# Altium project LAUNCHXL-CC1310.PrjPcb (part 2 of 4)

## Sheet 2_Peripherals.SchDoc
size 420 x 297 mm
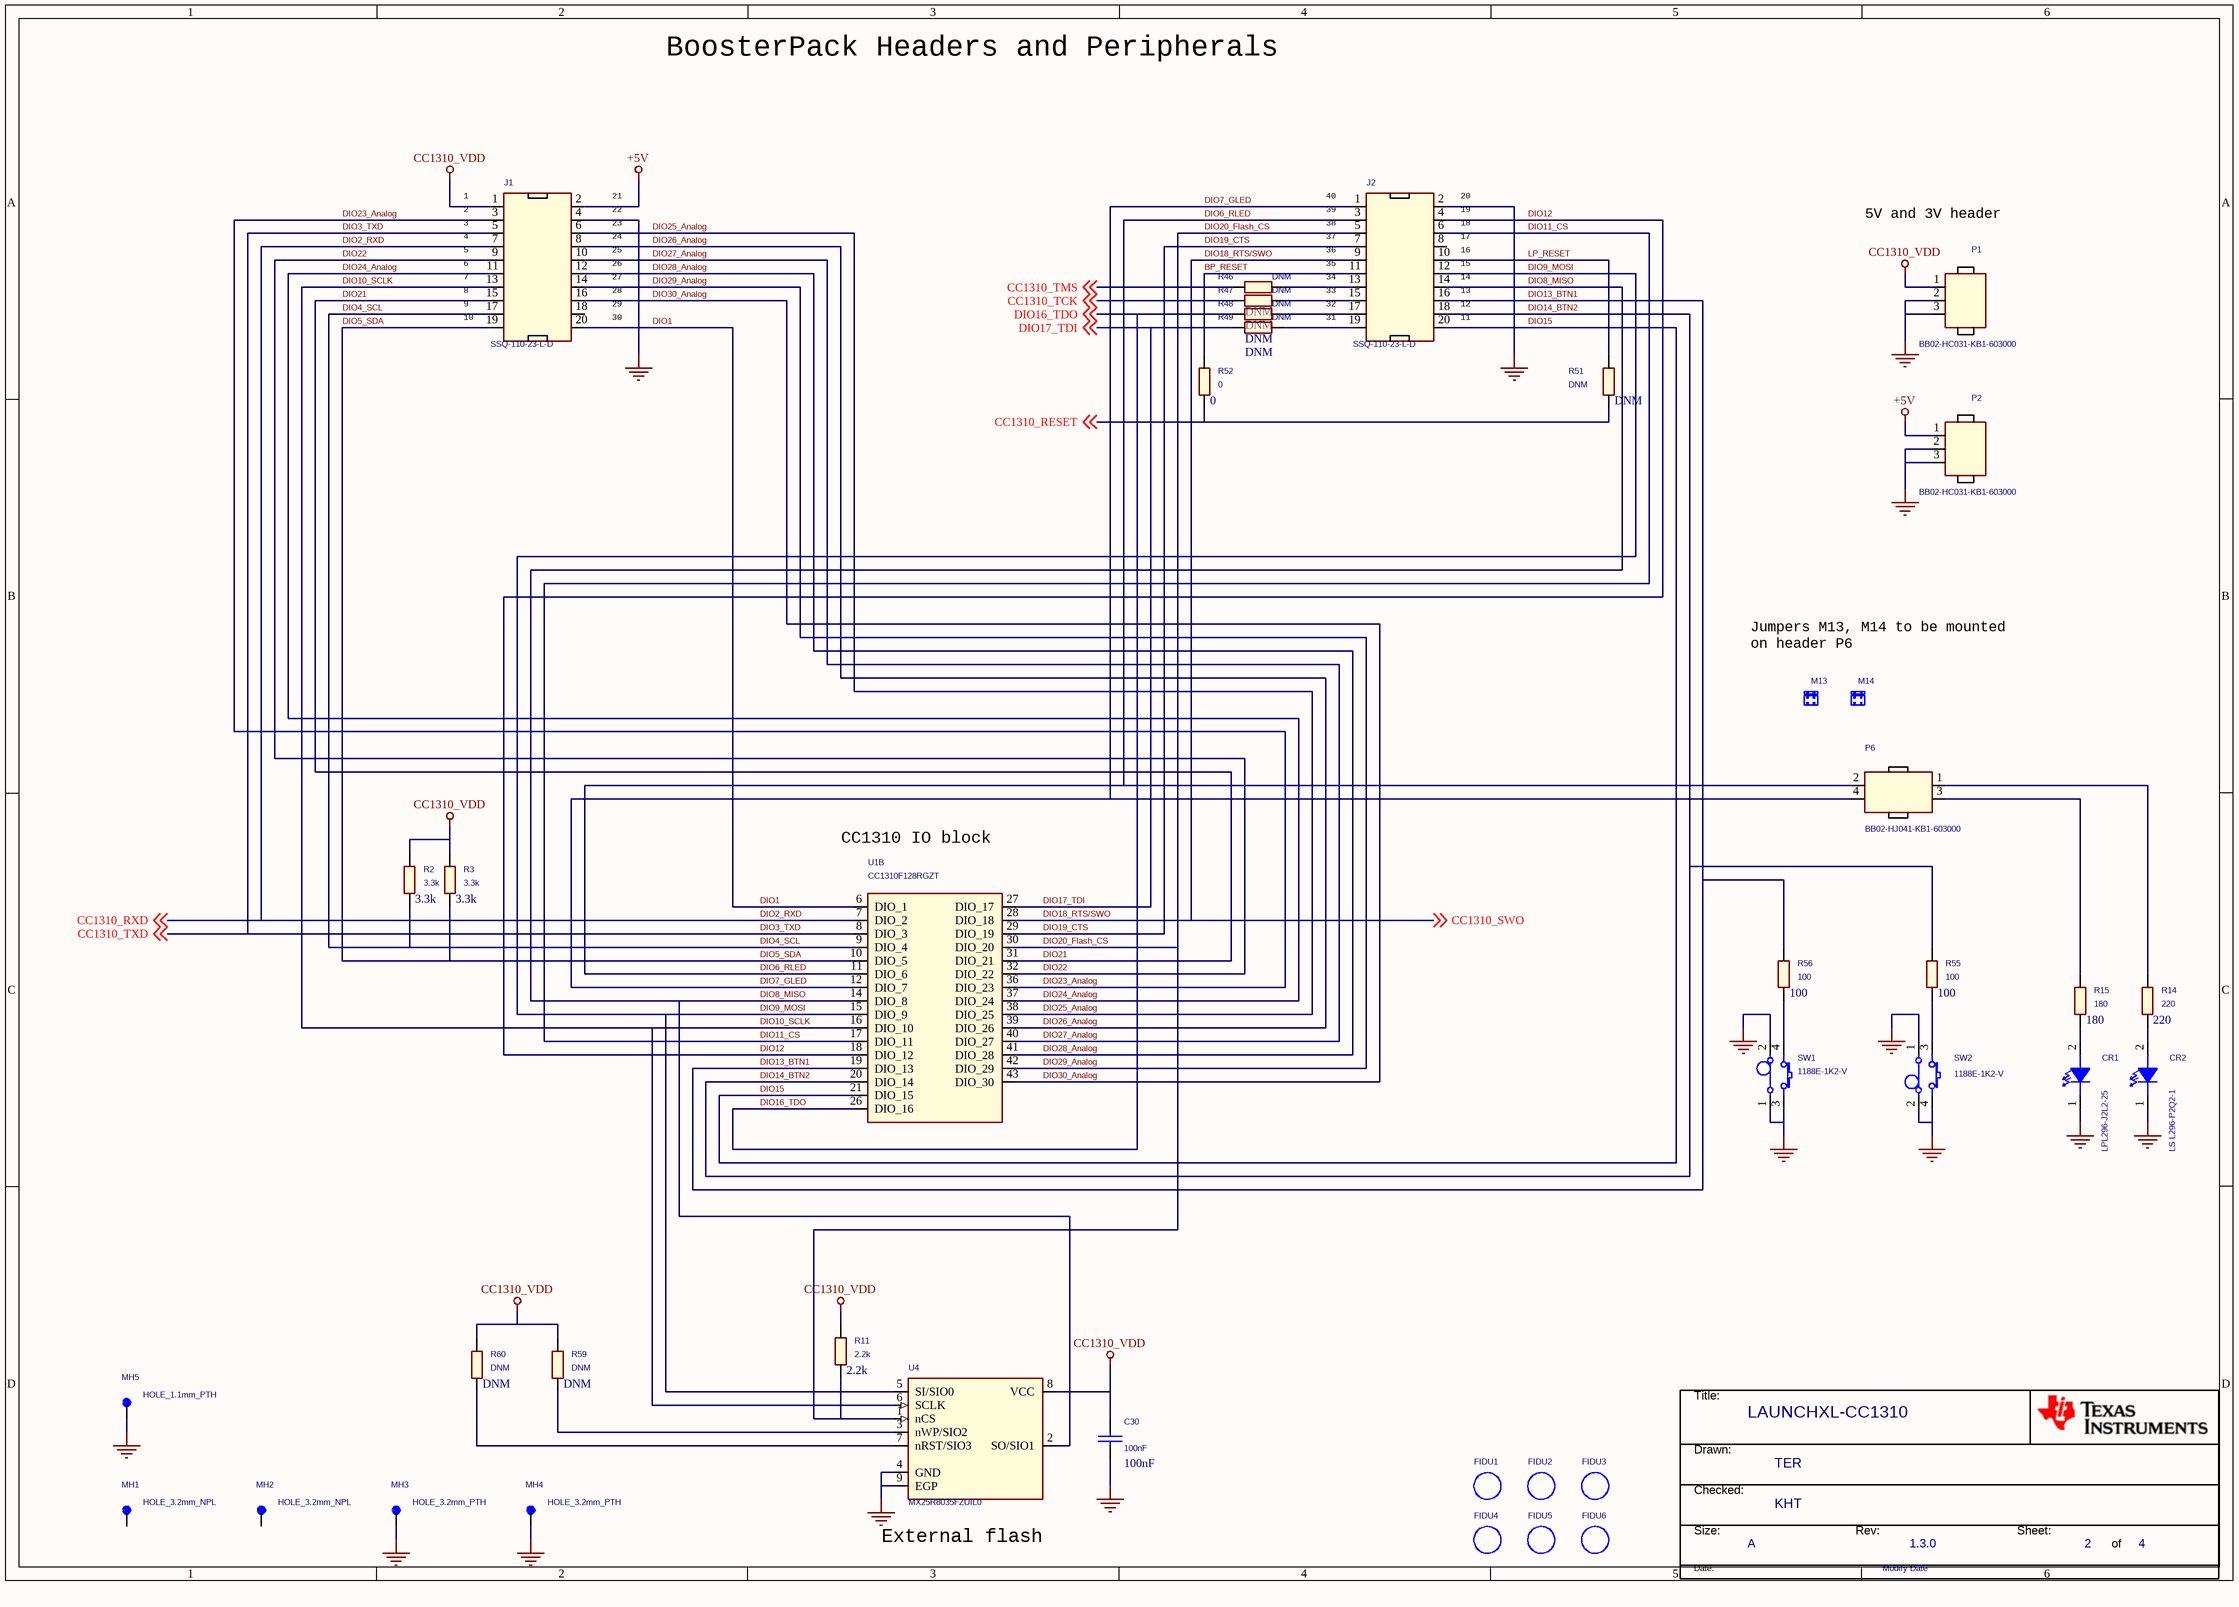
[diagram p1: 2_Peripherals.SchDoc]

### Parts
(Parts that share a designator on the sheet are numbered #1, #2 ... from top to bottom, then left to right.)
*#2  Designer name: KHT  Check name: TER  Design Modify Date: Modify Date  Page Size: A  RevCode: 1.3.0  Page Count: 4  Page Number: 2  Title: LAUNCHXL-CC1310  (hidden comment: TI_Norway_Title_Block_BMP)  (graphical)
C30  100nF  [CAPC1005X60B2N]
CR1  LPL296-J2L2-25  [LEDC1707X65L]
CR2  LS L296-P2Q2-1  [LEDC1708X67L]
FIDU1  FIDU_1.27mm  [FIDMARK]  (value not drawn)
FIDU2  FIDU_1.27mm  [FIDMARK]  (value not drawn)
FIDU3  FIDU_1.27mm  [FIDMARK]  (value not drawn)
FIDU4  FIDU_1.27mm  [FIDMARK]  (value not drawn)
FIDU5  FIDU_1.27mm  [FIDMARK]  (value not drawn)
FIDU6  FIDU_1.27mm  [FIDMARK]  (value not drawn)
J1  SSQ-110-23-L-D  [SAMTEC_SSQ11023LD_A2B]
J2  SSQ-110-23-L-D  [SAMTEC_SSQ11023LD_A2B]
M13  SNT-100-BK-G  (value not drawn)
M14  SNT-100-BK-G  (value not drawn)
MH1  HOLE_3.2mm_NPL  [MTG320]
MH2  HOLE_3.2mm_NPL  [MTG320]
MH3  HOLE_3.2mm_PTH  [MTG320_380]
MH4  HOLE_3.2mm_PTH  [MTG320_380]
MH5  HOLE_1.1mm_PTH  [MTG110_170]
P1  BB02-HC031-KB1-603000  [GRADCONN_BB02HC031KB1603000_A2B]
P2  BB02-HC031-KB1-603000  [GRADCONN_BB02HC031KB1603000_A2B]
P6  BB02-HJ041-KB1-603000  [GRADCONN_BB02HJ041KB1603000_A2B]
R2  3.3k  [RESC1005X40B2N]
R3  3.3k  [RESC1005X40B2N]
R11  2.2k  [RESC1005X40B2N]
R14  220  [RESC1005X40B2N]
R15  180  [RESC1005X40B2N]
R46  DNM  [RESC1608X55N]
R47  DNM  [RESC1608X55N]
R48  DNM  [RESC1608X55N]
R49  DNM  [RESC1608X55N]
R51  DNM  [RESC1608X55N]
R52  0  [RESC1608X55N]
R55  100  [RESC1005X40B2N]
R56  100  [RESC1005X40B2N]
R59  DNM  [RESC1005X40B2N]
R60  DNM  [RESC1005X40B2N]
SW1  1188E-1K2-V  [SW_1188E1K2V_A2N]
SW2  1188E-1K2-V  [SW_1188E1K2V_A2N]
U1  CC1310F128RGZT  [QFNFC50P700X700X100-49A2N]  (part B of 2)
U4  MX25R8035FZUIL0  [SON50P300X200X60-9B2L]

### Nets
+5V: J1.2 P2.1
CC1310_VDD: C30.1 J1.1 P1.1 R2.2 R3.2 R11.2 R59.2 R60.2 U4.8(VCC)
GND: C30.2 CR1.1(C) CR2.1(C) J1.4 J2.2 MH3.1 MH4.1 MH5.1 P1.2 P1.3 P2.2 P2.3 SW1.1 SW1.2 SW1.3 SW2.1 SW2.2 SW2.4 U4.4(GND) U4.9(EGP)  [project net ITDI]
BP_RESET: J2.11 R52.2
CC1310_RESET: R51.2 R52.1 ; off-sheet CC1310_RESET
CC1310_TCK: R47.2 ; off-sheet CC1310_TCK
CC1310_TMS: R46.2 ; off-sheet CC1310_TMS
DIO1: J1.20 U1.6(DIO_1)
DIO2_RXD: J1.7 U1.7(DIO_2) ; off-sheet CC1310_RXD  [also labelled CC1310_RXD]
DIO3_TXD: J1.5 U1.8(DIO_3) ; off-sheet CC1310_TXD  [also labelled CC1310_TXD]
DIO4_SCL: J1.17 R2.1 U1.9(DIO_4)
DIO5_SDA: J1.19 R3.1 U1.10(DIO_5)
DIO6_RLED: J2.3 P6.2 U1.11(DIO_6)
DIO7_GLED: J2.1 P6.4 U1.12(DIO_7)
DIO8_MISO: J2.14 U1.14(DIO_8) U4.2(SO/SIO1)
DIO9_MOSI: J2.12 U1.15(DIO_9) U4.5(SI/SIO0)
DIO10_SCLK: J1.13 U1.16(DIO_10) U4.6(SCLK)
DIO11_CS: J2.6 U1.17(DIO_11)
DIO12: J2.4 U1.18(DIO_12)
DIO13_BTN1: J2.16 R56.2 U1.19(DIO_13)
DIO14_BTN2: J2.18 R55.2 U1.20(DIO_14)
DIO15: J2.20 U1.21(DIO_15)
DIO16_TDO: R48.2 U1.26(DIO_16) ; off-sheet DIO16_TDO
DIO17_TDI: R49.2 U1.27(DIO_17) ; off-sheet DIO17_TDI
DIO18_RTS/SWO: J2.9 U1.28(DIO_18) ; off-sheet CC1310_SWO  [also labelled CC1310_SWO]
DIO19_CTS: J2.7 U1.29(DIO_19)
DIO20_Flash_CS: J2.5 R11.1 U1.30(DIO_20) U4.1(nCS)
DIO21: J1.15 U1.31(DIO_21)
DIO22: J1.9 U1.32(DIO_22)
DIO23_Analog: J1.3 U1.36(DIO_23)
DIO24_Analog: J1.11 U1.37(DIO_24)
DIO25_Analog: J1.6 U1.38(DIO_25)
DIO26_Analog: J1.8 U1.39(DIO_26)
DIO27_Analog: J1.10 U1.40(DIO_27)
DIO28_Analog: J1.12 U1.41(DIO_28)
DIO29_Analog: J1.14 U1.42(DIO_29)
DIO30_Analog: J1.16 U1.43(DIO_30)
LP_RESET: J2.10 R51.1
NetCR1_2: CR1.2(A) R15.1
NetCR2_2: CR2.2(A) R14.1
NetJ2_13: J2.13 R46.1
NetJ2_15: J2.15 R47.1
NetJ2_17: J2.17 R48.1
NetJ2_19: J2.19 R49.1
NetP6_1: P6.1 R14.2
NetP6_3: P6.3 R15.2
NetR55_1: R55.1 SW2.3
NetR56_1: R56.1 SW1.4
NetR59_1: R59.1 U4.3(nWP/SIO2)
NetR60_1: R60.1 U4.7(nRST/SIO3)

Not connected (* = marked no-connect by the designer): FIDU1 1; FIDU2 1; FIDU3 1; FIDU4 1; FIDU5 1; FIDU6 1; J1 18; J2 8; MH1 1; MH2 1

### Notes on the sheet
- BoosterPack Headers and Peripherals
- (near J1) 1
- (near J1) 2
- (near J1) 3
- (near J1) 4
- (near J1) 5
- (near J1) 21
- (near J1) 22
- (near J1) 23
- (near J1) 24
- (near J1) 25
- (near J2) 40
- (near J2) 39
- (near J2) 38
- (near J2) 37
- (near J2) 36
- (near J2) 20
- (near J2) 19
- (near J2) 18
- (near J2) 17
- (near J2) 16
- 5V and 3V header
- (near J1) 6
- (near J1) 7
- (near J1) 8
- (near J1) 9
- (near J1) 10
- (near J1) 26
- (near J1) 27
- (near J1) 28
- (near J1) 29
- (near J1) 30
- (near J2) 35
- (near J2) 34
- (near J2) 33
- (near J2) 32
- (near J2) 31
- (near J2) 15
- (near J2) 14
- (near J2) 13
- (near J2) 12
- (near J2) 11
- Jumpers M13, M14 to be mounted
  on header P6
- (near U1) CC1310 IO block
- (near U4) External flash
- (in symbol TI_Norway_Title_Block_BMP) Title:; Drawn:; Checked:; Size:; Rev:; Sheet:; of; Date:

### Library data of the parts
*#2 = TI_Norway_Title_Block_BMP: OrgName: Texas Instruments
C30 = CAPACITOR: CAPACITOR, CERAMIC X7R, 100nF, 6.3V, -10%/+10%, -55DEGC/+125DEGC, 0402, SMD; Part Number: 02-07610; Manufacturer: MANUFACTURER SELECTION; MPN: CAPACITOR_0402_100nF_X7R_M_+/-10%_10V; MPN Status: ACTIVE; Vendor Part Number: GRM155R70J104KA01D; Vendor Part Status: NRND; VOLTAGE: CMAX; CURRENT: CIMAX; KNEE: CBMAX; PSpiceTemplate: C^@REFDES %1 %2 ?TOLERANCE|C^@REFDES| @VALUE ?IC/IC=@IC/ TC=@TC1,@TC2 ?TOLERANCE|\n.model C^@REFDES CAP C=1 DEV=@TOLERANCE%|; DIST: FLAT; SLOPE: CSMAX; MAX_TEMP: CTMAX; TC1: 0; Definied Quality: INDUSTRIAL; Old Footprint: CAPC1005X60N; PCB Package: 0402; Max Tol: +10%; Min Tol: -10%; NOTE Status: PREFERRED; Lead Time: 14; Budget Price: 0.007; Budget Currency: EUR; Packing Size: 10000; Packing Type: TAPE_&_REEL; BU Name: TEXAS INSTRUMENTS NORWAY; Vendor: MURATA; TC2: 0; Value: 100nF; MSL: N/A; MTBF Standard: N/A; MTBF: N/A; Esd Level: N/A; Last Time Buy: N/A; Revision: R000; Mounting Type: SMD; Part Type: CAPACITOR\CERAMIC\0402\STANDARD; Max Oper Temp: +125DEGC; Min Oper Temp: -55DEGC; Rtd Voltage: 6.3V; Capacitance: 100nF; Dielectric Type: X7R; RoHS Status: ROHS_COMPLIANT; LifeCycle Status: ACTIVE; WEIGHT: 0.0016g; Datasheet URL 1: http://psearch.murata.com/capacitor/product/GRM155R70J104KA01%23.pdf; Datasheet URL 2: http://search.murata.co.jp/Ceramy/image/img/w_hinm/L0005E.pdf; AutoDoc File: https://notefied-dynamic-precision.com/DB/Apps/Desktop/Item/Object.aspx?id=113338; Country of Origin: PHILIPPINES
CR1 = LED: OPTO, LED, GREEN COLOR, 562nm, 0.02A, 0.08W, 0603, SMD; Part Number: 15-01023; Manufacturer: OSRAM; MPN Status: NRND; FPLIST: LEDC1707X65N,LEDC1707X65L,LEDC1707X65M; ALT_SYMBOLS: LEDC1707X65L,LEDC1707X65M; Old Footprint: LEDC1707X65N; PCB Package: 0603; Max Oper Temp: +100DEGC; Min Oper Temp: -40DEGC; Rtd Voltage: 2V; NOTE Status: NOT_PREFERRED; Lead Time: 8; Budget Price: 0.1263; Budget Currency: USD; Definied Quality: INDUSTRIAL; Packing Size: 5000; Packing Type: TAPE_&_REEL; Esd Level: HBM 2kV; Revision: R003; Mounting Type: SMD; Part Type: OPTO\LED\0603; Rtd Current: 0.02A; Rtd Power: 0.08W; MPN: LP L296-J2L2-25; RoHS Status: ROHS_COMPLIANT; Last Time Buy: N/A; WEIGHT: 0.002g; MTBF: N/A; MTBF Standard: N/A; MSL: 2; Datasheet URL 1: N/A; Datasheet URL 2: http://catalog.osram-os.com/jsp/download.jsp?rootPath=/media/&name=LP_L296.pdf&docPath=Graphics/00077128_0.pdf&url=/media//_en/Graphics/00077128_0.pdf; AutoDoc File: http://notefied-dynamic-precision.com/DB/Apps/Desktop/Item/Object.aspx?id=81622
CR2 = LED: OPTO, LED, SUPER RED COLOR, 630nm, 1.8V TO 2.3V, 0.06A, 0603, SMD; Part Number: 15-01169; Manufacturer: OSRAM; MPN Status: NRND; FPLIST: LEDC1708X67N,LEDC1708X67L,LEDC1708X67M; ALT_SYMBOLS: LEDC1708X67L,LEDC1708X67M; Old Footprint: LEDC1708X67N; PCB Package: 0603; Max Oper Temp: +100DEGC; Min Oper Temp: -40DEGC; NOTE Status: PREFERRED; Lead Time: 8; Budget Price: 0.089; Budget Currency: USD; Definied Quality: INDUSTRIAL; Packing Size: 5000; Packing Type: TAPE_&_REEL; Esd Level: HBM 2kV; PPCB Recomendation: Inactive for new design [Alert:0001]; Revision: R003; Mounting Type: SMD; Part Type: OPTO\LED\0603; Rtd Voltage: 1.8V TO 2.3V; Rtd Current: 0.06A; MPN: LS L296-P2Q2-1; RoHS Status: ROHS_COMPLIANT; Last Time Buy: N/A; WEIGHT: 0.002g; MTBF: N/A; MTBF Standard: N/A; MSL: 2; Datasheet URL 1: http://www.osram-os.com/osram_os/en/products/product-catalog/led-light-emitting-diodes/smartled-0603/ls-l296/index.jsp?search_result=%2fosram_os%2fen%2fsearch%2fadvanced_search.jsp%3faction%3ddosearch%26inp_searchterm_1%3dLS%2bL296-P2Q2-1%26website_name%3; Datasheet URL 2: http://www.osram-os.com/Graphics/XPic5/00077119_0.pdf/LS%20L296%20-%20SMARTLED%200603.pdf; AutoDoc File: http://notefied-dynamic-precision.com/DB/Apps/Desktop/Item/Object.aspx?id=88355
FIDU1-FIDU6 = FIDMARK: FIDUCIAL MARK, ROUND 1.27MM; Part Number: 19-00300; Part Type: NON_COMPONENT\FIDUCIAL
J1 J2 = CONN_HEADER_2X10_J_S_V1: CONNECTOR, HEADER, FEMALE, STRAIGHT, 2 ROWS, 20 ROWS, 2.54mm, PTH; MPN Status: ACTIVE; Manufacturer: SAMTEC; Part Number: 06-04997; CLASS: IO; Packing Type: BULK; Packing Size: 21; Definied Quality: INDUSTRIAL; Budget Currency: USD; Budget Price: 2.14; Lead Time: 1; NOTE Status: PREFERRED; No Of Rows: 2; No Of Pos: 20; Rtd Current: 6.3A; Min Oper Temp: -55DEGC; Max Oper Temp: +125DEGC; ALT_SYMBOLS: SAMTEC_SSQ11023LD_A2C,SAMTEC_SSQ11023LD_A2A; FPLIST: SAMTEC_SSQ11023LD_A2B,SAMTEC_SSQ11023LD_A2C,SAMTEC_SSQ11023LD_A2A; AutoDoc File: http://notefied-dynamic-precision.com/DB/Apps/Desktop/Item/Object.aspx?id=104387; Datasheet URL 2: http://suddendocs.samtec.com/catalog_english/ssq_th.pdf; Datasheet URL 1: http://suddendocs.samtec.com/prints/ssq-1xx-xx-xxx-x-xx-xxx-xx-x-mkt.pdf; MSL: N/A; Esd Level: N/A; WEIGHT: 2.45594g; LifeCycle Status: ACTIVE; RoHS Status: ROHS_COMPLIANT; MPN: SSQ-110-23-L-D; Pitch: 2.54mm; Part Type: CONNECTOR\HEADER; Mounting Type: PTH; Old Footprint: SAMTEC_SSQ11023LD_A2B; Revision: R001
M13 = MECH_SHUNT_JUMPER: MECHANIC, SHUNT, CURRENT RATING 4.3A PER PIN, 2.54 X 5.08 X 6.1mm, BLACK; MPN Status: ACTIVE; Manufacturer: SAMTEC; Part Number: 19-00498; Designed_By: Artur Bielinski; CLASS: DISCRETE; Packing Type: BULK; Packing Size: 1; Definied Quality: INDUSTRIAL; Budget Currency: USD; Budget Price: 0.146; NOTE Status: PREFERRED; Min Oper Temp: -55DEGC; Max Oper Temp: +125DEGC; Mounting Type: NOT APPLY; Design_Date: 2015-03-18; AutoDoc File: http://notefied-dynamic-precision.com/DB/Apps/Desktop/Item/Object.aspx?id=104092; Datasheet URL 2: http://suddendocs.samtec.com/catalog_english/snt.pdf; Datasheet URL 1: http://suddendocs.samtec.com/prints/snt-100-xx-x-x-mkt.pdf; MSL: N/A; MTBF Standard: N/A; MTBF: N/A; Esd Level: N/A; WEIGHT: N/A; Last Time Buy: N/A; Lead Time: 1; LifeCycle Status: ACTIVE; RoHS Status: ROHS_COMPLIANT; MPN: SNT-100-BK-G; Rtd Current: 4.3A; Part Type: MECHANIC\SHUNT; Revision: R001
M14 = MECH_SHUNT_JUMPER: MECHANIC, SHUNT, CURRENT RATING 4.3A PER PIN, 2.54 X 5.08 X 6.1mm, BLACK; Part Number: 19-00498; Manufacturer: SAMTEC; MPN Status: ACTIVE; Designed_By: Artur Bielinski; CLASS: DISCRETE; Mounting Type: NOT APPLY; Max Oper Temp: +125DEGC; Min Oper Temp: -55DEGC; NOTE Status: PREFERRED; Lead Time: 1; Budget Price: 0.146; Budget Currency: USD; Definied Quality: INDUSTRIAL; Packing Type: BULK; Design_Date: 2015-03-18; Revision: R001; Part Type: MECHANIC\SHUNT; Rtd Current: 4.3A; MPN: SNT-100-BK-G; RoHS Status: ROHS_COMPLIANT; LifeCycle Status: ACTIVE; Last Time Buy: N/A; Packing Size: 1; WEIGHT: N/A; Esd Level: N/A; MTBF: N/A; MTBF Standard: N/A; MSL: N/A; Datasheet URL 1: http://suddendocs.samtec.com/prints/snt-100-xx-x-x-mkt.pdf; Datasheet URL 2: http://suddendocs.samtec.com/catalog_english/snt.pdf; AutoDoc File: http://notefied-dynamic-precision.com/DB/Apps/Desktop/Item/Object.aspx?id=104092
MH1 MH2 = HOLE_NPL: NON COMPONENT, HOLE 3.2mm, NON PLATED HOLE; Part Number: 19-00029; FPLIST: MTG320,HOLE_80CIR126_32,; Old Footprint: MTG320,HOLE_80CIR126_32; Revision: R001; Part Type: NON_COMPONENT\HOLE\NON_PLATED; AutoDoc File: http://notefied-dynamic-precision.com/DB/Apps/Desktop/Item/Object.aspx?id=57308
MH3 MH4 = HOLE_PTH: NON COMPONENT, HOLE 3.2mm, PLATED HOLE; Part Number: 19-00083; Old Footprint: MTG320_380,HOLE_150CIR126_32; FPLIST: MTG320_380,HOLE_150CIR126_32,; AutoDoc File: http://notefied-dynamic-precision.com/DB/Apps/Desktop/Item/Object.aspx?id=57362; Part Type: NON_COMPONENT\HOLE\PLATED; Revision: R001
MH5 = HOLE_PTH: NON COMPONENT, HOLE 1.1mm, PLATED HOLE; Part Number: 19-00062; FPLIST: MTG110_170,; AutoDoc File: http://notefied-dynamic-precision.com/DB/Apps/Desktop/Item/Object.aspx?id=57341; Part Type: NON_COMPONENT\HOLE\PLATED; Old Footprint: MTG110_170; Revision: R001
P1 = CONN_HEADER_3_P_S: CONNECTOR, HEADER, MALE, STRAIGHT, 1 ROW, 3 PINS, PITCH 2.54mm, PTH; MPN Status: ACTIVE; Manufacturer: GRADCONN; Part Number: 06-05038; CLASS: IO; NOTE Status: PREFERRED; No Of Rows: 1; No Of Pos: 3; Rtd Current: 3A; Rtd Voltage: 250V; Min Oper Temp: -40DEGC; Max Oper Temp: +105DEGC; ALT_SYMBOLS: GRADCONN_BB02HC031KB1603000_A2C,GRADCONN_BB02HC031KB1603000_A2A; FPLIST: GRADCONN_BB02HC031KB1603000_A2B,GRADCONN_BB02HC031KB1603000_A2C,GRADCONN_BB02HC031KB1603000_A2A; AutoDoc File: http://notefied-dynamic-precision.com/DB/Apps/Desktop/Item/Object.aspx?id=104636; Datasheet URL 2: http://www.gradconn.com/Files/Specs/BTB-2.54mm-Header-specification.pdf; Datasheet URL 1: http://www.gradconn.com/Files/Drawings/BB02-HC.pdf; RoHS Status: ROHS_COMPLIANT; MPN: BB02-HC031-KB1-603000; Pitch: 2.54mm; Part Type: CONNECTOR\HEADER; Mounting Type: PTH; Old Footprint: GRADCONN_BB02HC031KB1603000_A2B; Revision: R001
P2 = CONN_HEADER_3_P_S: CONNECTOR, HEADER, MALE, STRAIGHT, 1 ROW, 3 PINS, PITCH 2.54mm, PTH; Part Number: 06-05038; Manufacturer: GRADCONN; MPN Status: ACTIVE; CLASS: IO; FPLIST: GRADCONN_BB02HC031KB1603000_A2B,GRADCONN_BB02HC031KB1603000_A2C,GRADCONN_BB02HC031KB1603000_A2A; ALT_SYMBOLS: GRADCONN_BB02HC031KB1603000_A2C,GRADCONN_BB02HC031KB1603000_A2A; Max Oper Temp: +105DEGC; Min Oper Temp: -40DEGC; Rtd Voltage: 250V; Rtd Current: 3A; No Of Pos: 3; No Of Rows: 1; NOTE Status: PREFERRED; Revision: R001; Old Footprint: GRADCONN_BB02HC031KB1603000_A2B; Mounting Type: PTH; Part Type: CONNECTOR\HEADER; Pitch: 2.54mm; MPN: BB02-HC031-KB1-603000; RoHS Status: ROHS_COMPLIANT; Datasheet URL 1: http://www.gradconn.com/Files/Drawings/BB02-HC.pdf; Datasheet URL 2: http://www.gradconn.com/Files/Specs/BTB-2.54mm-Header-specification.pdf; AutoDoc File: http://notefied-dynamic-precision.com/DB/Apps/Desktop/Item/Object.aspx?id=104636
P6 = CONN_HEADER_2X2_P: CONNECTOR, HEADER, MALE, STRAIGHT, 2 ROWS, 4 PINS, PITCH 2.54mm, PTH; Part Number: 06-04999; Manufacturer: GRADCONN; MPN Status: ACTIVE; CLASS: IO; FPLIST: GRADCONN_BB02HJ041KB1603000_A2B,GRADCONN_BB02HJ041KB1603000_A2C,GRADCONN_BB02HJ041KB1603000_A2A; ALT_SYMBOLS: GRADCONN_BB02HJ041KB1603000_A2C,GRADCONN_BB02HJ041KB1603000_A2A; Max Oper Temp: +105DEGC; Min Oper Temp: -40DEGC; Rtd Current: 3A; No Of Pos: 4; No Of Rows: 2; NOTE Status: PREFERRED; Revision: R001; Old Footprint: GRADCONN_BB02HJ041KB1603000_A2B; Mounting Type: PTH; Part Type: CONNECTOR\HEADER; Pitch: 2.54mm; MPN: BB02-HJ041-KB1-603000; RoHS Status: ROHS_COMPLIANT; Datasheet URL 1: http://www.gradconn.com/Files/Drawings/BB02-HJ.pdf; Datasheet URL 2: http://www.gradconn.com/Files/Specs/BTB-2.54mm-Header-specification.pdf; AutoDoc File: http://notefied-dynamic-precision.com/DB/Apps/Desktop/Item/Object.aspx?id=104391
R2 R3 = RESISTOR: RESISTOR, THICK FILM, 3.3k, -5%/+5%, 0.063W, 50V, -55DEGC/+155DEGC, 0402, SMD; MPN Status: ACTIVE; MPN: RESISTOR_0402_3.3k_+/-5%_50V_0.063W_M_+/-200ppm; Manufacturer: MANUFACTURER SELECTION; Part Number: 01-22351; PSpiceTemplate: R^@REFDES %1 %2 ?TOLERANCE|R^@REFDES| @VALUE TC=@TC1,@TC2 ?TOLERANCE|\n.model R^@REFDES RES R=1 DEV=@TOLERANCE%|; VOLTAGE: RVMAX; DIST: FLAT; MAX_TEMP: RTMAX; TC1: 0; POWER: RMAX; Packing Type: TAPE_&_REEL; Packing Size: 10000; Definied Quality: INDUSTRIAL; Budget Currency: USD; Budget Price: 0.00244; NOTE Status: PREFERRED; Min TC: -200PPM/DEGC; Max TC: +200PPM/DEGC; Min Tol: -5%; Max Tol: +5%; PCB Package: 0402; Old Footprint: RESC1005X40N; BU Name: TEXAS INSTRUMENTS NORWAY; TC2: 0; Value: 3.3k; AutoDoc File: https://notefied-dynamic-precision.com/DB/Apps/Desktop/Item/Object.aspx?id=113324; Datasheet URL 2: N/A; Datasheet URL 1: N/A; MSL: N/A; MTBF Standard: N/A; MTBF: N/A; Esd Level: N/A; WEIGHT: N/A; Last Time Buy: N/A; Lead Time: N/A; LifeCycle Status: ACTIVE; RoHS Status: ROHS_COMPLIANT; Resistor Type: THICK FILM; Resistance: 3.3k; Rtd Power: 0.063W; Rtd Current: N/A; Rtd Voltage: 50V; Min Oper Temp: -55DEGC; Max Oper Temp: +155DEGC; Part Type: RESISTOR\0402\STANDARD; Mounting Type: SMD; Revision: R000; Vendor: MANUFACTURER SELECTION; Vendor Part Number: RESISTOR_0402_3.3k_+/-5%_50V_0.063W_M_+/-200ppm; Vendor Part Status: ACTIVE; Country of Origin: MISSING INFO
R11 = RESISTOR: RESISTOR, THICK FILM, 2.2k, -5%/+5%, 0.063W, 50V, -55DEGC/+155DEGC, 0402, SMD; Part Number: 01-22350; Manufacturer: MANUFACTURER SELECTION; MPN: RESISTOR_0402_2.2k_+/-5%_50V_0.063W_M_+/-200ppm; MPN Status: ACTIVE; PSpiceTemplate: R^@REFDES %1 %2 ?TOLERANCE|R^@REFDES| @VALUE TC=@TC1,@TC2 ?TOLERANCE|\n.model R^@REFDES RES R=1 DEV=@TOLERANCE%|; VOLTAGE: RVMAX; DIST: FLAT; MAX_TEMP: RTMAX; TC1: 0; POWER: RMAX; Old Footprint: RESC1005X40N; PCB Package: 0402; Max Tol: +5%; Min Tol: -5%; Max TC: +200PPM/DEGC; Min TC: -200PPM/DEGC; NOTE Status: PREFERRED; Budget Price: 0.00244; Budget Currency: USD; Definied Quality: INDUSTRIAL; Packing Size: 10000; Packing Type: TAPE_&_REEL; BU Name: TEXAS INSTRUMENTS NORWAY; TC2: 0; Value: 2.2k; Revision: R000; Mounting Type: SMD; Part Type: RESISTOR\0402\STANDARD; Max Oper Temp: +155DEGC; Min Oper Temp: -55DEGC; Rtd Voltage: 50V; Rtd Current: N/A; Rtd Power: 0.063W; Resistance: 2.2k; Resistor Type: THICK FILM; RoHS Status: ROHS_COMPLIANT; LifeCycle Status: ACTIVE; Lead Time: N/A; Last Time Buy: N/A; WEIGHT: N/A; Esd Level: N/A; MTBF: N/A; MTBF Standard: N/A; MSL: N/A; Datasheet URL 1: N/A; Datasheet URL 2: N/A; AutoDoc File: https://notefied-dynamic-precision.com/DB/Apps/Desktop/Item/Object.aspx?id=113323; Vendor: MANUFACTURER SELECTION; Vendor Part Number: RESISTOR_0402_2.2k_+/-5%_50V_0.063W_M_+/-200ppm; Vendor Part Status: ACTIVE; Country of Origin: MISSING INFO
R14 = RESISTOR: RESISTOR, THICK FILM, 220, -5%/+5%, 0.063W, 50V, -55DEGC/+155DEGC, 0402, SMD; MPN Status: ACTIVE; MPN: RESISTOR_0402_220_+/-5%_50V_0.063W_M_+/-200ppm; Manufacturer: MANUFACTURER SELECTION; Part Number: 01-22346; PSpiceTemplate: R^@REFDES %1 %2 ?TOLERANCE|R^@REFDES| @VALUE TC=@TC1,@TC2 ?TOLERANCE|\n.model R^@REFDES RES R=1 DEV=@TOLERANCE%|; VOLTAGE: RVMAX; DIST: FLAT; MAX_TEMP: RTMAX; TC1: 0; POWER: RMAX; Packing Type: TAPE_&_REEL; Packing Size: 10000; Definied Quality: INDUSTRIAL; Budget Currency: USD; Budget Price: 0.00244; NOTE Status: PREFERRED; Min TC: -200PPM/DEGC; Max TC: +200PPM/DEGC; Min Tol: -5%; Max Tol: +5%; PCB Package: 0402; Old Footprint: RESC1005X40N; BU Name: TEXAS INSTRUMENTS NORWAY; TC2: 0; Value: 220; AutoDoc File: https://notefied-dynamic-precision.com/DB/Apps/Desktop/Item/Object.aspx?id=113319; Datasheet URL 2: N/A; Datasheet URL 1: N/A; MSL: N/A; MTBF Standard: N/A; MTBF: N/A; Esd Level: N/A; WEIGHT: N/A; Last Time Buy: N/A; Lead Time: N/A; LifeCycle Status: ACTIVE; RoHS Status: ROHS_COMPLIANT; Resistor Type: THICK FILM; Resistance: 220; Rtd Power: 0.063W; Rtd Current: N/A; Rtd Voltage: 50V; Min Oper Temp: -55DEGC; Max Oper Temp: +155DEGC; Part Type: RESISTOR\0402\STANDARD; Mounting Type: SMD; Revision: R000; Vendor: MANUFACTURER SELECTION; Vendor Part Number: RESISTOR_0402_220_+/-5%_50V_0.063W_M_+/-200ppm; Vendor Part Status: ACTIVE; Country of Origin: MISSING INFO
R15 = RESISTOR: RESISTOR, THICK FILM, 180, -5%/+5%, 0.063W, 50V, -55DEGC/+155DEGC, 0402, SMD; MPN Status: ACTIVE; MPN: RESISTOR_0402_180_+/-5%_50V_0.063W_M_+/-200ppm; Manufacturer: MANUFACTURER SELECTION; Part Number: 01-22345; PSpiceTemplate: R^@REFDES %1 %2 ?TOLERANCE|R^@REFDES| @VALUE TC=@TC1,@TC2 ?TOLERANCE|\n.model R^@REFDES RES R=1 DEV=@TOLERANCE%|; VOLTAGE: RVMAX; DIST: FLAT; MAX_TEMP: RTMAX; TC1: 0; POWER: RMAX; Packing Type: TAPE_&_REEL; Packing Size: 10000; Definied Quality: INDUSTRIAL; Budget Currency: USD; Budget Price: 0.00244; NOTE Status: PREFERRED; Min TC: -200PPM/DEGC; Max TC: +200PPM/DEGC; Min Tol: -5%; Max Tol: +5%; PCB Package: 0402; Old Footprint: RESC1005X40N; BU Name: TEXAS INSTRUMENTS NORWAY; TC2: 0; Value: 180; AutoDoc File: https://notefied-dynamic-precision.com/DB/Apps/Desktop/Item/Object.aspx?id=113318; Datasheet URL 2: N/A; Datasheet URL 1: N/A; MSL: N/A; MTBF Standard: N/A; MTBF: N/A; Esd Level: N/A; WEIGHT: N/A; Last Time Buy: N/A; Lead Time: N/A; LifeCycle Status: ACTIVE; RoHS Status: ROHS_COMPLIANT; Resistor Type: THICK FILM; Resistance: 180; Rtd Power: 0.063W; Rtd Current: N/A; Rtd Voltage: 50V; Min Oper Temp: -55DEGC; Max Oper Temp: +155DEGC; Part Type: RESISTOR\0402\STANDARD; Mounting Type: SMD; Revision: R000; Vendor: MANUFACTURER SELECTION; Vendor Part Number: RESISTOR_0402_180_+/-5%_50V_0.063W_M_+/-200ppm; Vendor Part Status: ACTIVE; Country of Origin: MISSING INFO
R46 = RESISTOR: RESISTOR, DO NOT MOUNT, 0603, SMD; Part Number: 01-02493; MPN Status: ACTIVE; PSpiceTemplate: R^@REFDES %1 %2 ?TOLERANCE|R^@REFDES| @VALUE TC=@TC1,@TC2 ?TOLERANCE|\n.model R^@REFDES RES R=1 DEV=@TOLERANCE%|; VOLTAGE: RVMAX; DIST: FLAT; MAX_TEMP: RTMAX; TC1: 0; POWER: RMAX; FPLIST: RESC1608X55N,RESC1608X55L,RESC1608X55M; ALT_SYMBOLS: RESC1608X55L,RESC1608X55M; Old Footprint: RESC1608X55N,0603; PCB Package: 0603; NOTE Status: PREFERRED; TC2: 0; Value: DNM; Revision: R001; Mounting Type: SMD; Part Type: RESISTOR\0603\STANDARD; Max Oper Temp: N/A; Min Oper Temp: N/A; Max Tol: N/A; Min Tol: N/A; Max TC: N/A; Min TC: N/A; Rtd Voltage: N/A; Rtd Current: N/A; Rtd Power: N/A; Resistance: DNM; Resistor Type: N/A; Manufacturer: DO NOT MOUNT; MPN: DNM; RoHS Status: MISSING_INFO; LifeCycle Status: ACTIVE; Lead Time: N/A; Budget Price: N/A; Budget Currency: N/A; Last Time Buy: N/A; Packing Size: N/A; WEIGHT: N/A; Esd Level: N/A; MTBF: N/A; MTBF Standard: N/A; MSL: N/A; Datasheet URL 1: N/A; Datasheet URL 2: N/A; AutoDoc File: http://notefied-dynamic-precision.com/DB/Apps/Desktop/Item/Object.aspx?id=48377
R47-R49 R51 = RESISTOR: RESISTOR, DO NOT MOUNT, 0603, SMD; MPN Status: ACTIVE; Part Number: 01-02493; PSpiceTemplate: R^@REFDES %1 %2 ?TOLERANCE|R^@REFDES| @VALUE TC=@TC1,@TC2 ?TOLERANCE|\n.model R^@REFDES RES R=1 DEV=@TOLERANCE%|; VOLTAGE: RVMAX; DIST: FLAT; MAX_TEMP: RTMAX; TC1: 0; POWER: RMAX; NOTE Status: PREFERRED; PCB Package: 0603; Old Footprint: RESC1608X55N,0603; ALT_SYMBOLS: RESC1608X55L,RESC1608X55M; FPLIST: RESC1608X55N,RESC1608X55L,RESC1608X55M; TC2: 0; Value: DNM; AutoDoc File: http://notefied-dynamic-precision.com/DB/Apps/Desktop/Item/Object.aspx?id=48377; Datasheet URL 2: N/A; Datasheet URL 1: N/A; MSL: N/A; MTBF Standard: N/A; MTBF: N/A; Esd Level: N/A; WEIGHT: N/A; Packing Size: N/A; Last Time Buy: N/A; Budget Currency: N/A; Budget Price: N/A; Lead Time: N/A; LifeCycle Status: ACTIVE; RoHS Status: MISSING_INFO; MPN: DNM; Manufacturer: DO NOT MOUNT; Resistor Type: N/A; Resistance: DNM; Rtd Power: N/A; Rtd Current: N/A; Rtd Voltage: N/A; Min TC: N/A; Max TC: N/A; Min Tol: N/A; Max Tol: N/A; Min Oper Temp: N/A; Max Oper Temp: N/A; Part Type: RESISTOR\0603\STANDARD; Mounting Type: SMD; Revision: R001
R52 = RESISTOR: RESISTOR, THICK FILM, 0, 0.1W, 75V, -55DEGC/+155DEGC, 0603, SMD; MPN Status: ACTIVE; MPN: RESISTOR_0603_0_+/-5%_75V_0.1W_M_+/-200ppm; Manufacturer: MANUFACTURER SELECTION; Part Number: 01-11757; PSpiceTemplate: R^@REFDES %1 %2 ?TOLERANCE|R^@REFDES| @VALUE TC=@TC1,@TC2 ?TOLERANCE|\n.model R^@REFDES RES R=1 DEV=@TOLERANCE%|; VOLTAGE: RVMAX; DIST: FLAT; MAX_TEMP: RTMAX; POWER: RMAX; Packing Type: TAPE_&_REEL; Packing Size: 5000; Definied Quality: INDUSTRIAL; Budget Currency: USD; Budget Price: 0.00262; NOTE Status: PREFERRED; Min TC: -200PPM/DEGC; Max TC: +200PPM/DEGC; PCB Package: 0603; ALT_SYMBOLS: RESC1608X55L,RESC1608X55M; FPLIST: RESC1608X55N,RESC1608X55L,RESC1608X55M; TC1: 0; TC2: 0; Value: 0; AutoDoc File: http://notefied-dynamic-precision.com/DB/Apps/Desktop/Item/Object.aspx?id=75812; Datasheet URL 2: N/A; Datasheet URL 1: N/A; MSL: N/A; MTBF Standard: N/A; MTBF: N/A; Esd Level: N/A; WEIGHT: 0.002g; Last Time Buy: N/A; Lead Time: N/A; LifeCycle Status: ACTIVE; RoHS Status: ROHS_COMPLIANT; Resistor Type: THICK FILM; Resistance: 0; Rtd Power: 0.1W; Rtd Current: N/A; Rtd Voltage: 75V; Min Tol: N/A; Max Tol: N/A; Min Oper Temp: -55DEGC; Max Oper Temp: +155DEGC; Part Type: RESISTOR\0603\JUMPER; Mounting Type: SMD; Old Footprint: RESC1608X55N; Revision: R000
R55 R56 = RESISTOR: RESISTOR, THICK FILM, 100, -5%/+5%, 0.063W, 50V, -55DEGC/+155DEGC, 0402, SMD; Part Number: 01-22343; Manufacturer: MANUFACTURER SELECTION; MPN: RESISTOR_0402_100_+/-5%_50V_0.063W_M_+/-200ppm; MPN Status: ACTIVE; PSpiceTemplate: R^@REFDES %1 %2 ?TOLERANCE|R^@REFDES| @VALUE TC=@TC1,@TC2 ?TOLERANCE|\n.model R^@REFDES RES R=1 DEV=@TOLERANCE%|; VOLTAGE: RVMAX; DIST: FLAT; MAX_TEMP: RTMAX; TC1: 0; POWER: RMAX; Old Footprint: RESC1005X40N; PCB Package: 0402; Max Tol: +5%; Min Tol: -5%; Max TC: +200PPM/DEGC; Min TC: -200PPM/DEGC; NOTE Status: PREFERRED; Budget Price: 0.00244; Budget Currency: USD; Definied Quality: INDUSTRIAL; Packing Size: 10000; Packing Type: TAPE_&_REEL; BU Name: TEXAS INSTRUMENTS NORWAY; TC2: 0; Value: 100; Revision: R000; Mounting Type: SMD; Part Type: RESISTOR\0402\STANDARD; Max Oper Temp: +155DEGC; Min Oper Temp: -55DEGC; Rtd Voltage: 50V; Rtd Current: N/A; Rtd Power: 0.063W; Resistance: 100; Resistor Type: THICK FILM; RoHS Status: ROHS_COMPLIANT; LifeCycle Status: ACTIVE; Lead Time: N/A; Last Time Buy: N/A; WEIGHT: N/A; Esd Level: N/A; MTBF: N/A; MTBF Standard: N/A; MSL: N/A; Datasheet URL 1: N/A; Datasheet URL 2: N/A; AutoDoc File: https://notefied-dynamic-precision.com/DB/Apps/Desktop/Item/Object.aspx?id=113316; Vendor: MANUFACTURER SELECTION; Vendor Part Number: RESISTOR_0402_100_+/-5%_50V_0.063W_M_+/-200ppm; Vendor Part Status: ACTIVE; Country of Origin: MISSING INFO
R59 = RESISTOR: RESISTOR, DO NOT MOUNT, 0402, SMD; Vendor Part Status: ACTIVE; Part Number: 01-22339; PSpiceTemplate: R^@REFDES %1 %2 ?TOLERANCE|R^@REFDES| @VALUE TC=@TC1,@TC2 ?TOLERANCE|\n.model R^@REFDES RES R=1 DEV=@TOLERANCE%|; VOLTAGE: RVMAX; DIST: FLAT; MAX_TEMP: RTMAX; TC1: 0; POWER: RMAX; BU Name: TEXAS INSTRUMENTS NORWAY; Old Footprint: RESC1005X40N,0402; PCB Package: 0402; NOTE Status: PREFERRED; TC2: 0; Value: DNM; Country of Origin: MISSING INFO; Vendor Part Number: DNM; Vendor: DO NOT MOUNT; Revision: R000; Mounting Type: SMD; Part Type: RESISTOR\0402\STANDARD; Max Oper Temp: N/A; Min Oper Temp: N/A; Max Tol: N/A; Min Tol: N/A; Max TC: N/A; Min TC: N/A; Rtd Voltage: N/A; Rtd Current: N/A; Rtd Power: N/A; Resistance: N/A; Resistor Type: THICK FILM; Manufacturer: DO NOT MOUNT; MPN: DNM; MPN Status: ACTIVE; RoHS Status: MISSING_INFO; LifeCycle Status: ACTIVE; Lead Time: N/A; Budget Price: N/A; Budget Currency: N/A; Last Time Buy: N/A; Packing Size: N/A; WEIGHT: N/A; Esd Level: N/A; MTBF: N/A; MTBF Standard: N/A; MSL: N/A; Datasheet URL 1: N/A; Datasheet URL 2: N/A; AutoDoc File: https://notefied-dynamic-precision.com/DB/Apps/Desktop/Item/Object.aspx?id=113312
R60 = RESISTOR: RESISTOR, DO NOT MOUNT, 0402, SMD; Part Number: 01-22339; MPN Status: ACTIVE; PSpiceTemplate: R^@REFDES %1 %2 ?TOLERANCE|R^@REFDES| @VALUE TC=@TC1,@TC2 ?TOLERANCE|\n.model R^@REFDES RES R=1 DEV=@TOLERANCE%|; VOLTAGE: RVMAX; DIST: FLAT; MAX_TEMP: RTMAX; TC1: 0; POWER: RMAX; Old Footprint: RESC1005X40N,0402; PCB Package: 0402; NOTE Status: PREFERRED; BU Name: TEXAS INSTRUMENTS NORWAY; TC2: 0; Value: DNM; Revision: R000; Mounting Type: SMD; Part Type: RESISTOR\0402\STANDARD; Max Oper Temp: N/A; Min Oper Temp: N/A; Max Tol: N/A; Min Tol: N/A; Max TC: N/A; Min TC: N/A; Rtd Voltage: N/A; Rtd Current: N/A; Rtd Power: N/A; Resistance: N/A; Resistor Type: THICK FILM; Manufacturer: DO NOT MOUNT; MPN: DNM; RoHS Status: MISSING_INFO; LifeCycle Status: ACTIVE; Lead Time: N/A; Budget Price: N/A; Budget Currency: N/A; Last Time Buy: N/A; Packing Size: N/A; WEIGHT: N/A; Esd Level: N/A; MTBF: N/A; MTBF Standard: N/A; MSL: N/A; Datasheet URL 1: N/A; Datasheet URL 2: N/A; AutoDoc File: https://notefied-dynamic-precision.com/DB/Apps/Desktop/Item/Object.aspx?id=113312; Vendor: DO NOT MOUNT; Vendor Part Number: DNM; Vendor Part Status: ACTIVE; Country of Origin: MISSING INFO
SW1 = SWITCH_TACT_V2: SWITCH, TACT, 0.05A@250VAC, 0.05A@12VDC, 0.05A, 250V, SMD; MPN Status: ACTIVE; MPN: 1188E-1K2-V-TR; Manufacturer: DIPTRONICS; Part Number: 08-00293; Designed_By: Artur Bielinski; CLASS: DISCRETE; Packing Type: TAPE_&_REEL; Packing Size: 1500; NOTE Status: PREFERRED; Rtd Voltage: 12V; Min Oper Temp: -25DEGC; Max Oper Temp: +70DEGC; ALT_SYMBOLS: SW_1188E1K2V_A2L,SW_1188E1K2V_A2M; FPLIST: SW_1188E1K2V_A2N,SW_1188E1K2V_A2L,SW_1188E1K2V_A2M; Design_Date: 2014-08-07; AutoDoc File: http://notefied-dynamic-precision.com/DB/Apps/Desktop/Item/Object.aspx?id=104642; Datasheet URL 2: http://www.dip.com.tw/en/en-product-information/en-switch004; Datasheet URL 1: N/A; RoHS Status: ROHS_COMPLIANT; Rtd Current: 0.05A; Part Type: SWITCH\TACT; Mounting Type: SMD; Old Footprint: SW_1188E1K2V_A2N; Revision: R001
SW2 = SWITCH_TACT_V2: SWITCH, TACT, 0.05A@250VAC, 0.05A@12VDC, 0.05A, 250V, SMD; Part Number: 08-00293; Manufacturer: DIPTRONICS; MPN: 1188E-1K2-V-TR; MPN Status: ACTIVE; Designed_By: Artur Bielinski; CLASS: DISCRETE; FPLIST: SW_1188E1K2V_A2N,SW_1188E1K2V_A2L,SW_1188E1K2V_A2M; ALT_SYMBOLS: SW_1188E1K2V_A2L,SW_1188E1K2V_A2M; Max Oper Temp: +70DEGC; Min Oper Temp: -25DEGC; Rtd Voltage: 12V; NOTE Status: PREFERRED; Packing Size: 1500; Packing Type: TAPE_&_REEL; Design_Date: 2014-08-07; Revision: R001; Old Footprint: SW_1188E1K2V_A2N; Mounting Type: SMD; Part Type: SWITCH\TACT; Rtd Current: 0.05A; RoHS Status: ROHS_COMPLIANT; Datasheet URL 1: N/A; Datasheet URL 2: http://www.dip.com.tw/en/en-product-information/en-switch004; AutoDoc File: http://notefied-dynamic-precision.com/DB/Apps/Desktop/Item/Object.aspx?id=104642
U1 = IC_RF_CC1310F128RGZT_VQFN48: IC, MICROCONTROLLER, 128kB, 1.8V TO 3.8V, VQFN48-EP, SMD; Part Number: 18-32855; Vendor Part Status: ACTIVE; SWAP_INFO: (S1+S2); SPLIT_INST: TRUE; Designed_By: Artur Bielinski; BU Name: DYNAMIC PRECISION GDANSK; ALT_SYMBOLS: QFNFC50P700X700X100-49A2L,QFNFC50P700X700X100-49A2M; Max Oper Temp: +85DEGC; Min Oper Temp: -40DEGC; Vendor: TEXAS INSTRUMENTS; Client Status: UNDER_REVIEW; Lead Time: 2; Budget Price: 4.69; Budget Currency: EUR; Packing Size: 250; Packing Type: TAPE_&_REEL; CLASS: IC; Design_Date: 2015-11-27; Revision: R001; PCB Package: VQFN48-EP; Mounting Type: SMD; Part Type: IC\MICROCONTROLLER\TEXAS_INSTRUMENTS; Rtd Voltage: 1.8V TO 3.8V; Vendor Part Number: CC1310F128RGZT; RoHS Status: ROHS_COMPLIANT; Datasheet URL 1: http://www.ti.com/lit/ds/symlink/cc1310.pdf; AutoDoc File: https://notefied-dynamic-precision.com/DB/Apps/Desktop/Item/Object.aspx?id=113282
U4 = IC_FLASH_MX25R8035F_USON8: IC, MEMORY, FLASH, SERIAL, 8Mbit, 1.65V TO 3.6V, USON8, SMD; MPN Status: ACTIVE; Manufacturer: MACRONIX; Part Number: 18-31726; Designed_By: Artur Bielinski; NOTE Status: PREFERRED; Min Oper Temp: -40DEGC; Max Oper Temp: +85DEGC; Old Footprint: SON50P300X200X60-9B2N; ALT_SYMBOLS: SON50P300X200X60-9B2L,SON50P300X200X60-9B2M; FPLIST: SON50P300X200X60-9B2N,SON50P300X200X60-9B2L,SON50P300X200X60-9B2M; Design_Date: 2015-08-05; CLASS: IC; AutoDoc File: http://notefied-dynamic-precision.com/DB/Apps/Desktop/Item/Object.aspx?id=104624; Datasheet URL 2: http://www.macronix.com/Lists/DataSheet/Attachments/2570/MX25R8035F,%20Wide%20Range,%208Mb,%20v0.04.pdf; Datasheet URL 1: N/A; RoHS Status: ROHS_COMPLIANT; MPN: MX25R8035FZUIL0; Rtd Voltage: 1.65V TO 3.6V; Part Type: IC\MEMORY\FLASH\OTHER; Mounting Type: SMD; PCB Package: USON8; Revision: R001

## Sheet 4_XDS110.SchDoc
size 420 x 297 mm
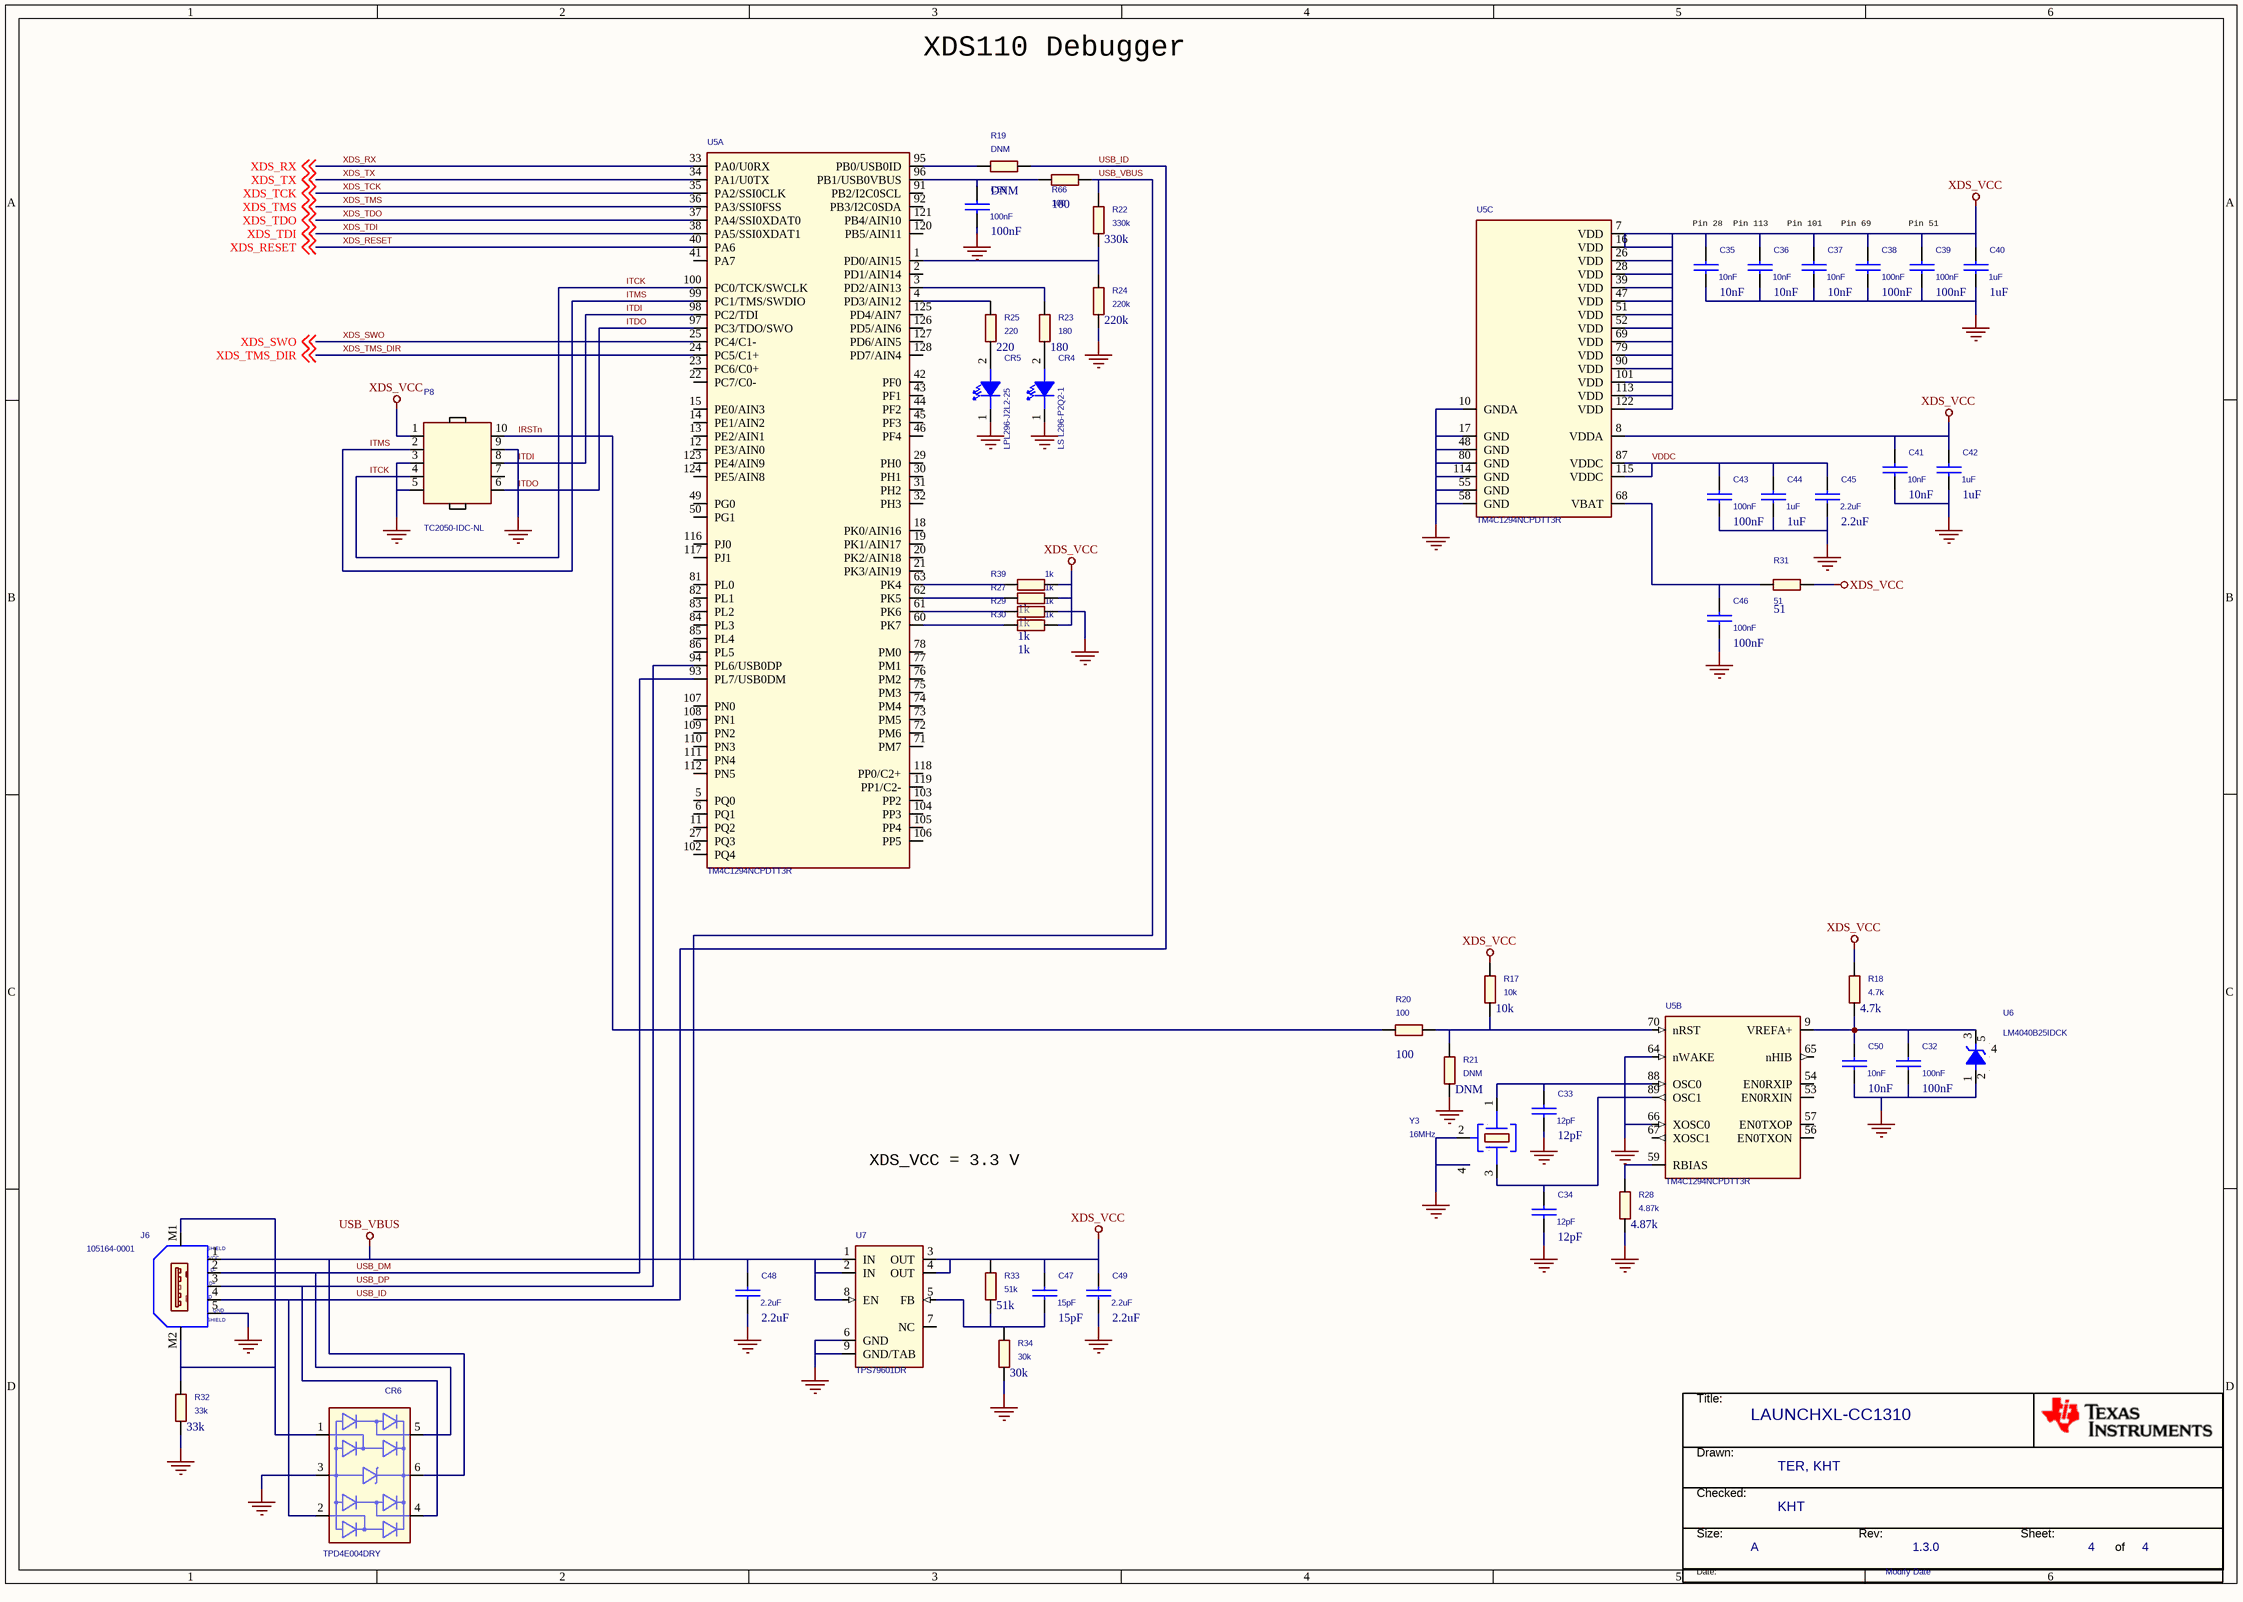
[diagram p2: 4_XDS110.SchDoc]

### Parts
(Parts that share a designator on the sheet are numbered #1, #2 ... from top to bottom, then left to right.)
*#3  Designer name: KHT  Check name: TER, KHT  Design Modify Date: Modify Date  Page Size: A  RevCode: 1.3.0  Page Count: 4  Title: LAUNCHXL-CC1310  (hidden comment: TI_Norway_Title_Block_BMP)  (graphical)
C32  100nF  [CAPC1005X60B2N]
C33  12pF  [CAPC1005X60B2N]
C34  12pF  [CAPC1005X60B2N]
C35  10nF  [CAPC1005X60B2N]
C36  10nF  [CAPC1005X60B2N]
C37  10nF  [CAPC1005X60B2N]
C38  100nF  [CAPC1005X60B2N]
C39  100nF  [CAPC1005X60B2N]
C40  1uF  [CAPC1005X60B2N]
C41  10nF  [CAPC1005X60B2N]
C42  1uF  [CAPC1005X60B2N]
C43  100nF  [CAPC1005X60B2N]
C44  1uF  [CAPC1005X60B2N]
C45  2.2uF  [CAPC1005X60B2N]
C46  100nF  [CAPC1005X60B2N]
C47  15pF  [CAPC1005X60B2N]
C48  2.2uF  [CAPC1005X60B2N]
C49  2.2uF  [CAPC1005X60B2N]
C50  10nF  [CAPC1005X60B2N]
C59  100nF  [CAPC1005X60B2N]
CR4  LS L296-P2Q2-1  [LEDC1708X67L]
CR5  LPL296-J2L2-25  [LEDC1707X65L]
CR6  TPD4E004DRY  [SON50P100X145X60-6N]
J6  105164-0001  [MOLEX_1051640001_A2N]
P8  TC2050-IDC-NL  [TAGCONNECT_TC2050IDCNLN]
R17  10k  [RESC1005X40B2N]
R18  4.7k  [RESC1005X40B2N]
R19  DNM  [RESC1005X40B2N]
R20  100  [RESC1005X40B2N]
R21  DNM  [RESC1005X40B2N]
R22  330k  [RESC1005X40B2N]
R23  180  [RESC1005X40B2N]
R24  220k  [RESC1005X40B2N]
R25  220  [RESC1005X40B2N]
R27  1k  [RESC1005X40B2N]
R28  4.87k  [RESC1005X40B2N]
R29  1k  [RESC1005X40B2N]
R30  1k  [RESC1005X40B2N]
R31  51  [RESC1005X40B2N]
R32  33k  [RESC1005X40B2N]
R33  51k  [RESC1005X40B2N]
R34  30k  [RESC1005X40B2N]
R39  1k  [RESC1005X40B2N]
R66  100  [RESC1005X40B2N]
U5  TM4C1294NCPDTT3R  [QFP40P1600X1600X120-128N]  (parts A,B,C of 3)
U6  LM4040B25IDCK  [SOT65P210X110-5N]
U7  TPS79601DR  [SON65P300X300X100-9AL]
Y3  16MHz  [OSCCC250X320X100-4BN]

### Nets
ITDI: C32.2 C33.2 C34.2 C35.2 C36.2 C37.2 C38.2 C39.2 C40.2 C41.2 C42.2 C43.2 C44.2 C45.2 C46.2 C48.2 C49.2 C50.2 C59.2 CR4.1(C) CR5.1(C) CR6.3 J6.5(GND) P8.3 P8.5 P8.6 P8.8 P8.9 R21.2 R24.2 R28.1 R29.2 R32.1 R34.1 U5.10(GNDA) U5.17(GND) U5.48(GND) U5.55(GND) U5.58(GND) U5.64(nWAKE) U5.66(XOSC0) U5.80(GND) U5.97(PC3/TDO/SWO) U5.98(PC2/TDI) U5.114(GND) U6.1(ANODE) U7.6(GND) U7.9(GND/TAB) Y3.2(GND) Y3.4(NC_4)  [also labelled GND, ITDO]
USB_VBUS: C48.1 CR6.6 J6.1(VCC) R22.2 R66.1 U7.1(IN) U7.2(IN) U7.8(EN)
XDS_VCC: C35.1 C36.1 C37.1 C38.1 C39.1 C40.1 C41.1 C42.1 C47.1 C49.1 P8.1 R17.2 R18.2 R27.1 R30.2 R31.2 R33.2 R39.1 U5.7(VDD) U5.8(VDDA) U5.16(VDD) U5.26(VDD) U5.28(VDD) U5.39(VDD) U5.47(VDD) U5.51(VDD) U5.52(VDD) U5.69(VDD) U5.79(VDD) U5.90(VDD) U5.101(VDD) U5.113(VDD) U5.122(VDD) U7.3(OUT) U7.4(OUT)
IRSTn: P8.10 R20.2
ITCK: P8.4 U5.100(PC0/TCK/SWCLK)
ITMS: P8.2 U5.99(PC1/TMS/SWDIO)
USB_DM: CR6.5 J6.2(D-) U5.93(PL7/USB0DM)
USB_DP: CR6.4 J6.3(D+) U5.94(PL6/USB0DP)
USB_ID: CR6.2 J6.4(ID) R19.1
VDDC: C43.1 C44.1 C45.1 U5.87(VDDC) U5.115(VDDC)
XDS_RESET: U5.40(PA6) ; off-sheet XDS_RESET
XDS_RX: U5.33(PA0/U0RX) ; off-sheet XDS_RX
XDS_SWO: U5.25(PC4/C1-) ; off-sheet XDS_SWO
XDS_TCK: U5.35(PA2/SSI0CLK) ; off-sheet XDS_TCK
XDS_TDI: U5.38(PA5/SSI0XDAT1) ; off-sheet XDS_TDI
XDS_TDO: U5.37(PA4/SSI0XDAT0) ; off-sheet XDS_TDO
XDS_TMS: U5.36(PA3/SSI0FSS) ; off-sheet XDS_TMS
XDS_TMS_DIR: U5.24(PC5/C1+) ; off-sheet XDS_TMS_DIR
XDS_TX: U5.34(PA1/U0TX) ; off-sheet XDS_TX
NetC32_1: C32.1 C50.1 R18.1 U5.9(VREFA+) U6.3(CATHODE)
NetC33_1: C33.1 U5.88(OSC0) Y3.1
NetC34_1: C34.1 U5.89(OSC1) Y3.3
NetC46_1: C46.1 R31.1 U5.68(VBAT)
NetC47_2: C47.2 R33.1 R34.2 U7.5(FB)
NetC59_1: C59.1 R66.2 U5.96(PB1/USB0VBUS)
NetCR4_2: CR4.2(A) R23.1
NetCR5_2: CR5.2(A) R25.1
NetCR6_1: CR6.1 J6.M1(SHIELD1) J6.M2(SHIELD2) R32.2
NetR17_1: R17.1 R20.1 R21.1 U5.70(nRST)
NetR19_2: R19.2 U5.95(PB0/USB0ID)
NetR22_1: R22.1 R24.1 U5.1(PD0/AIN15)
NetR23_2: R23.2 U5.3(PD2/AIN13)
NetR25_2: R25.2 U5.4(PD3/AIN12)
NetR27_2: R27.2 U5.62(PK5)
NetR28_2: R28.2 U5.59(RBIAS)
NetR29_1: R29.1 U5.61(PK6)
NetR30_1: R30.1 U5.60(PK7)
NetR39_2: R39.2 U5.63(PK4)

Not connected (* = marked no-connect by the designer): P8 7(9); U5 2(PD1/AIN14) 5(PQ0) 6(PQ1) 11(PQ2) 12(PE3/AIN0) 13(PE2/AIN1) 14(PE1/AIN2) 15(PE0/AIN3) 18(PK0/AIN16) 19(PK1/AIN17) 20(PK2/AIN18) 21(PK3/AIN19) 22(PC7/C0-) 23(PC6/C0+) 27(PQ3) 29(PH0) 30(PH1) 31(PH2) 32(PH3) 41(PA7) 42(PF0) 43(PF1) 44(PF2) 45(PF3) 46(PF4) 49(PG0) 50(PG1) 53(EN0RXIN) 54(EN0RXIP) 56(EN0TXON) 57(EN0TXOP) 65(nHIB) 67(XOSC1) 71(PM7) 72(PM6) 73(PM5) 74(PM4) 75(PM3) 76(PM2) 77(PM1) 78(PM0) 81(PL0) 82(PL1) 83(PL2) 84(PL3) 85(PL4) 86(PL5) 91(PB2/I2C0SCL) 92(PB3/I2C0SDA) 102(PQ4) 103(PP2) 104(PP3) 105(PP4) 106(PP5) 107(PN0) 108(PN1) 109(PN2) 110(PN3) 111(PN4) 112(PN5) 116(PJ0) 117(PJ1) 118(PP0/C2+) 119(PP1/C2-) 120(PB5/AIN11) 121(PB4/AIN10) 123(PE4/AIN9) 124(PE5/AIN8) 125(PD4/AIN7) 126(PD5/AIN6) 127(PD6/AIN5) 128(PD7/AIN4); U6 2(NC_2) 4(NC_4) 5(NC_5); U7 7(NC)

### Notes on the sheet
- XDS110 Debugger
- (near C35) Pin 28
- Pin 113
- Pin 101
- Pin 69
- (near C39) Pin 51
- XDS_VCC = 3.3 V
- (in symbol CONN_USB_MICRO_B_2MH) SHIELD
- (in symbol TI_Norway_Title_Block_BMP) Title:; Drawn:; Checked:; Size:; Rev:; Sheet:; of; Date: